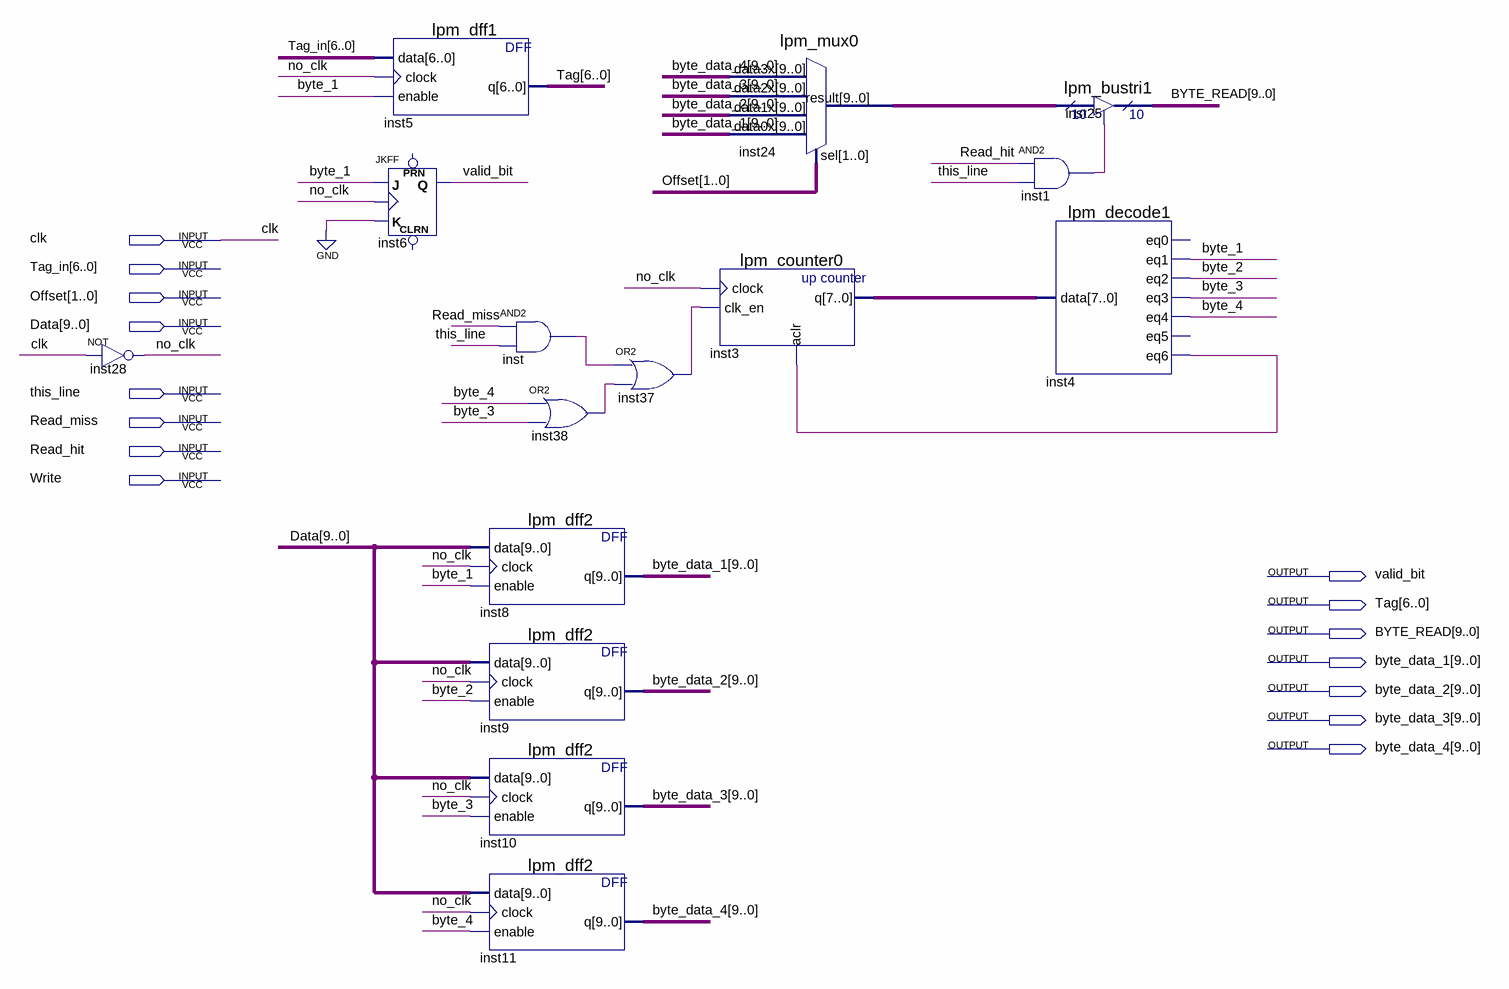
[diagram p0: schematic sheet]
// Quartus schematic LINE.bdf as structural Verilog: 15 symbols, 15 pins
module LINE (
  input  clk,
  input  [6:0] Tag_in,
  input  [1:0] Offset,
  input  [9:0] Data,
  input  this_line,
  input  Read_miss,
  input  Read_hit,
  input  Write,
  output valid_bit,
  output [6:0] Tag,
  output [9:0] BYTE_READ,
  output [9:0] byte_data_1,
  output [9:0] byte_data_2,
  output [9:0] byte_data_3,
  output [9:0] byte_data_4
);

  wire byte_1, byte_2, byte_3, byte_4, inst1_out, inst4_eq6, inst37_out, inst38_out, inst_out, no_clk;
  wire [7:0] inst3_q;
  wire [9:0] inst24_result;

  not inst28 (no_clk, clk);
  lpm_dff1 inst5 (.data(Tag_in), .clock(no_clk), .enable(byte_1), .q(Tag));
  JKFF inst6 (.K(1'b0), .J(byte_1), .CLK(no_clk), .Q(valid_bit));  // open: PRN, CLRN
  and inst (inst_out, Read_miss, this_line);
  lpm_dff2 inst8 (.data(Data), .clock(no_clk), .enable(byte_1), .q(byte_data_1));
  lpm_dff2 inst9 (.data(Data), .clock(no_clk), .enable(byte_2), .q(byte_data_2));
  lpm_dff2 inst10 (.data(Data), .clock(no_clk), .enable(byte_3), .q(byte_data_3));
  lpm_dff2 inst11 (.data(Data), .clock(no_clk), .enable(byte_4), .q(byte_data_4));
  or inst38 (inst38_out, byte_4, byte_3);
  or inst37 (inst37_out, inst_out, inst38_out);
  lpm_mux0 inst24 (
    .data3x(byte_data_4), .data2x(byte_data_3), .data1x(byte_data_2), .data0x(byte_data_1), .sel(Offset),
    .result(inst24_result));
  lpm_counter0 inst3 (.clock(no_clk), .clk_en(inst37_out), .aclr(inst4_eq6), .q(inst3_q));
  and inst1 (inst1_out, Read_hit, this_line);
  lpm_decode1 inst4 (
    .data(inst3_q), .eq1(byte_1), .eq2(byte_2), .eq3(byte_3), .eq4(byte_4), .eq6(inst4_eq6));  // open: eq0, eq5
  lpm_bustri1 inst25 (.enabledt(inst1_out), .data(inst24_result), .tridata(BYTE_READ));
endmodule
